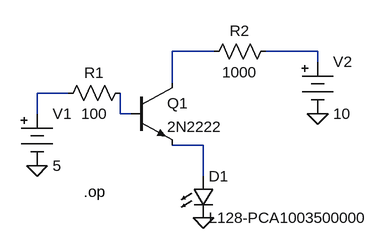
[diagram p0: schematic Transistor_Switch.asc]
Transistor_Switch.asc, the LTspice schematic file:
Version 4
SHEET 1 880 680
WIRE 256 32 192 32
WIRE 416 32 336 32
WIRE 416 48 416 32
WIRE 192 80 192 32
WIRE 32 96 -16 96
WIRE -16 128 -16 96
WIRE 112 128 112 96
WIRE 128 128 112 128
WIRE 240 176 192 176
WIRE 240 224 240 176
FLAG -16 208 0
FLAG 240 288 0
FLAG 416 128 0
SYMBOL Misc\\battery -16 112 R0
SYMATTR InstName V1
SYMATTR Value 5
SYMBOL Misc\\battery 416 32 R0
SYMATTR InstName V2
SYMATTR Value 10
SYMBOL npn 128 80 R0
SYMATTR InstName Q1
SYMATTR Value 2N2222
SYMBOL res 128 80 R90
WINDOW 0 0 56 VBottom 2
WINDOW 3 32 56 VTop 2
SYMATTR InstName R1
SYMATTR Value 100
SYMBOL res 352 16 R90
WINDOW 0 0 56 VBottom 2
WINDOW 3 32 56 VTop 2
SYMATTR InstName R2
SYMATTR Value 1000
SYMBOL LED 224 224 R0
SYMATTR InstName D1
SYMATTR Value L128-PCA1003500000
SYMATTR Description Diode
SYMATTR Type diode
TEXT 56 248 Left 2 !.op

The netlist it stands for:
* Transistor_Switch.asc
V1 N003 0 5
V2 N002 0 10
Q1 N001 N004 N005 0 2N2222
R1 N004 N003 100
R2 N002 N001 1000
D1 N005 0 L128-PCA1003500000
.model D D
.lib standard.dio
.model NPN NPN
.model PNP PNP
.lib standard.bjt
.op
.backanno
.end